# Altium schematic sheet led_ring.SchDoc
size A4
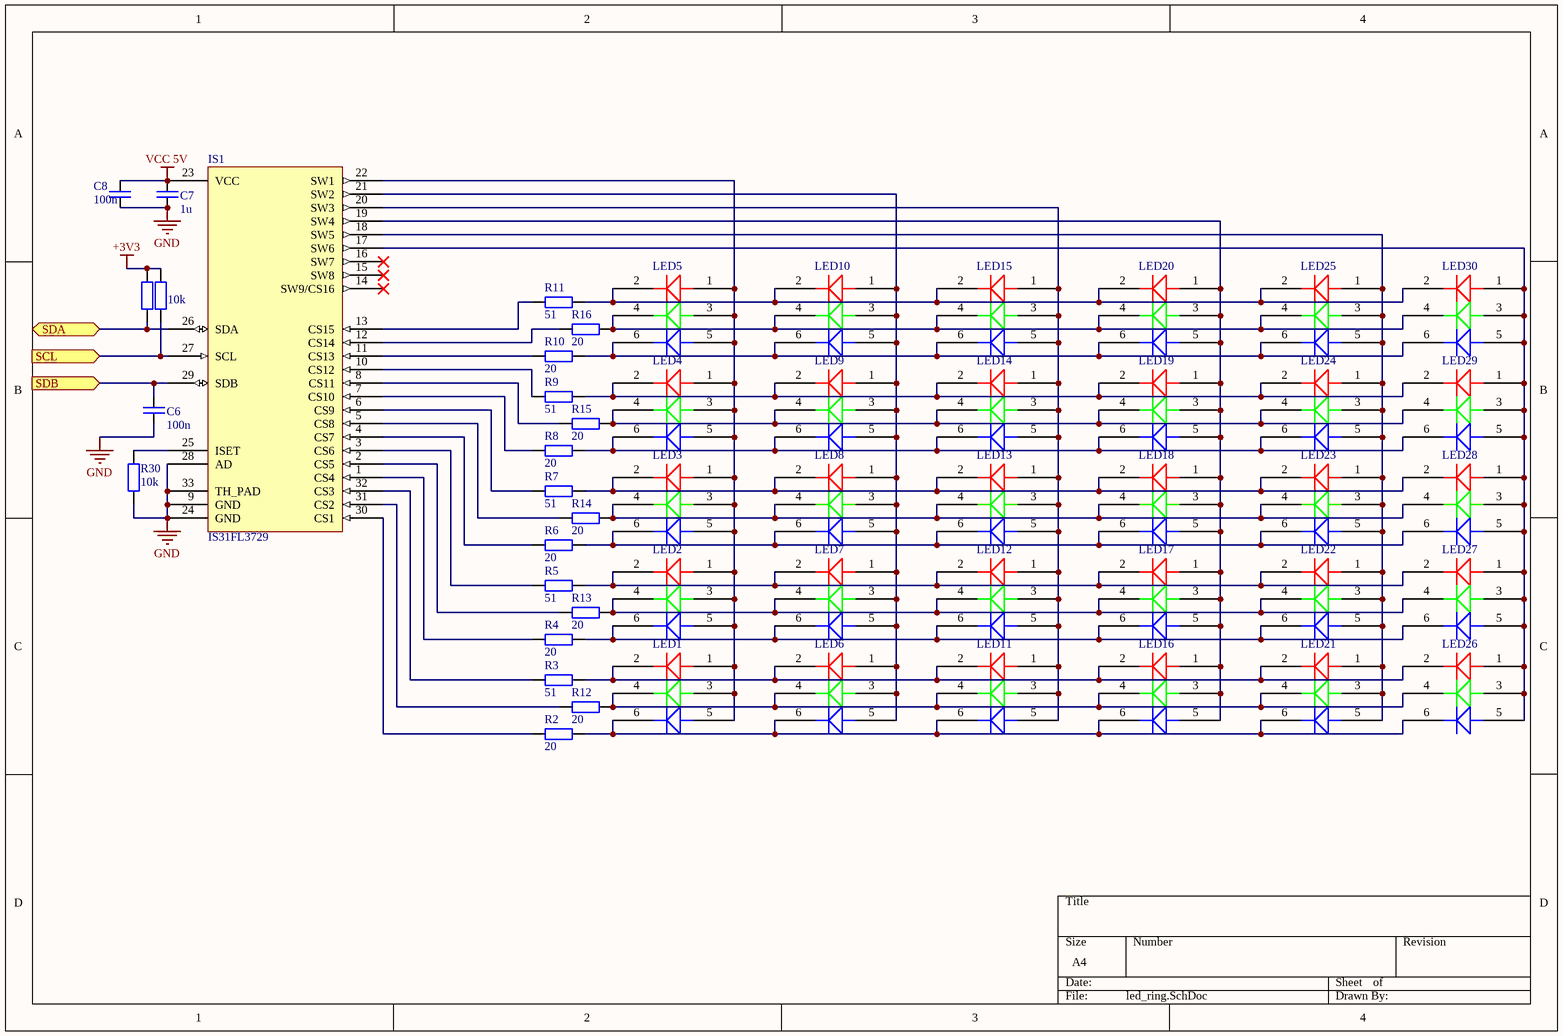
[diagram p0: led_ring.SchDoc]

## Parts
C6  100n  [R1005_0402i_L]
C7  1u  [C1608_0603I_L]
C8  100n  [R1005_0402i_L]
IS1  IS31FL3729  [QFN40P400X400X80_HS-33L]
LED1  SMB-LED  [ASMB-LED]  (value not drawn)
LED2  SMB-LED  [ASMB-LED]  (value not drawn)
LED3  SMB-LED  [ASMB-LED]  (value not drawn)
LED4  SMB-LED  [ASMB-LED]  (value not drawn)
LED5  SMB-LED  [ASMB-LED]  (value not drawn)
LED6  SMB-LED  [ASMB-LED]  (value not drawn)
LED7  SMB-LED  [ASMB-LED]  (value not drawn)
LED8  SMB-LED  [ASMB-LED]  (value not drawn)
LED9  SMB-LED  [ASMB-LED]  (value not drawn)
LED10  SMB-LED  [ASMB-LED]  (value not drawn)
LED11  SMB-LED  [ASMB-LED]  (value not drawn)
LED12  SMB-LED  [ASMB-LED]  (value not drawn)
LED13  SMB-LED  [ASMB-LED]  (value not drawn)
LED14  SMB-LED  [ASMB-LED]  (value not drawn)
LED15  SMB-LED  [ASMB-LED]  (value not drawn)
LED16  SMB-LED  [ASMB-LED]  (value not drawn)
LED17  SMB-LED  [ASMB-LED]  (value not drawn)
LED18  SMB-LED  [ASMB-LED]  (value not drawn)
LED19  SMB-LED  [ASMB-LED]  (value not drawn)
LED20  SMB-LED  [ASMB-LED]  (value not drawn)
LED21  SMB-LED  [ASMB-LED]  (value not drawn)
LED22  SMB-LED  [ASMB-LED]  (value not drawn)
LED23  SMB-LED  [ASMB-LED]  (value not drawn)
LED24  SMB-LED  [ASMB-LED]  (value not drawn)
LED25  SMB-LED  [ASMB-LED]  (value not drawn)
LED26  SMB-LED  [ASMB-LED]  (value not drawn)
LED27  SMB-LED  [ASMB-LED]  (value not drawn)
LED28  SMB-LED  [ASMB-LED]  (value not drawn)
LED29  SMB-LED  [ASMB-LED]  (value not drawn)
LED30  SMB-LED  [ASMB-LED]  (value not drawn)
R2  20  [R1005_0402i_L]
R3  51  [R1005_0402i_L]
R4  20  [R1005_0402i_L]
R5  51  [R1005_0402i_L]
R6  20  [R1005_0402i_L]
R7  51  [R1005_0402i_L]
R8  20  [R1005_0402i_L]
R9  51  [R1005_0402i_L]
R10  20  [R1005_0402i_L]
R11  51  [R1005_0402i_L]
R12  20  [R1005_0402i_L]
R13  20  [R1005_0402i_L]
R14  20  [R1005_0402i_L]
R15  20  [R1005_0402i_L]
R16  20  [R1005_0402i_L]
R27  10k  [R1005_0402i_L]  (value not drawn)
R28  10k  [R1005_0402i_L]
R30  10k  [R1005_0402i_L]

## Ports
SCL (in), SDA (bidir), SDB (in)

## Nets
+3V3: R27.1 R28.1
GND: C6.2 C7.2 C8.2 IS1.9(GND) IS1.24(GND) IS1.28(AD) IS1.33(TH_PAD) R30.2
VCC 5V: C7.1 C8.1 IS1.23(VCC)
SCL: IS1.27(SCL) R28.2 ; port SCL
SDA: IS1.26(SDA) R27.2 ; port SDA
SDB: C6.1 IS1.29(SDB) ; port SDB
NetIS1_1: IS1.1(CS4) R4.1
NetIS1_2: IS1.2(CS5) R13.1
NetIS1_3: IS1.3(CS6) R5.1
NetIS1_4: IS1.4(CS7) R6.1
NetIS1_5: IS1.5(CS8) R14.1
NetIS1_6: IS1.6(CS9) R7.1
NetIS1_7: IS1.7(CS10) R8.1
NetIS1_8: IS1.8(CS11) R15.1
NetIS1_10: IS1.10(CS12) R9.1
NetIS1_11: IS1.11(CS13) R10.1
NetIS1_12: IS1.12(CS14) R16.1
NetIS1_13: IS1.13(CS15) R11.1
NetIS1_17: IS1.17(SW6) LED26.1 LED26.3 LED26.5 LED27.1 LED27.3 LED27.5 LED28.1 LED28.3 LED28.5 LED29.1 LED29.3 LED29.5 LED30.1 LED30.3 LED30.5
NetIS1_18: IS1.18(SW5) LED21.1 LED21.3 LED21.5 LED22.1 LED22.3 LED22.5 LED23.1 LED23.3 LED23.5 LED24.1 LED24.3 LED24.5 LED25.1 LED25.3 LED25.5
NetIS1_19: IS1.19(SW4) LED16.1 LED16.3 LED16.5 LED17.1 LED17.3 LED17.5 LED18.1 LED18.3 LED18.5 LED19.1 LED19.3 LED19.5 LED20.1 LED20.3 LED20.5
NetIS1_20: IS1.20(SW3) LED11.1 LED11.3 LED11.5 LED12.1 LED12.3 LED12.5 LED13.1 LED13.3 LED13.5 LED14.1 LED14.3 LED14.5 LED15.1 LED15.3 LED15.5
NetIS1_21: IS1.21(SW2) LED6.1 LED6.3 LED6.5 LED7.1 LED7.3 LED7.5 LED8.1 LED8.3 LED8.5 LED9.1 LED9.3 LED9.5 LED10.1 LED10.3 LED10.5
NetIS1_22: IS1.22(SW1) LED1.1 LED1.3 LED1.5 LED2.1 LED2.3 LED2.5 LED3.1 LED3.3 LED3.5 LED4.1 LED4.3 LED4.5 LED5.1 LED5.3 LED5.5
NetIS1_25: IS1.25(ISET) R30.1
NetIS1_30: IS1.30(CS1) R2.1
NetIS1_31: IS1.31(CS2) R12.1
NetIS1_32: IS1.32(CS3) R3.1
NetLED1_2: LED1.2 LED6.2 LED11.2 LED16.2 LED21.2 LED26.2 R3.2
NetLED1_4: LED1.4 LED6.4 LED11.4 LED16.4 LED21.4 LED26.4 R12.2
NetLED1_6: LED1.6 LED6.6 LED11.6 LED16.6 LED21.6 LED26.6 R2.2
NetLED2_2: LED2.2 LED7.2 LED12.2 LED17.2 LED22.2 LED27.2 R5.2
NetLED2_4: LED2.4 LED7.4 LED12.4 LED17.4 LED22.4 LED27.4 R13.2
NetLED2_6: LED2.6 LED7.6 LED12.6 LED17.6 LED22.6 LED27.6 R4.2
NetLED3_2: LED3.2 LED8.2 LED13.2 LED18.2 LED23.2 LED28.2 R7.2
NetLED3_4: LED3.4 LED8.4 LED13.4 LED18.4 LED23.4 LED28.4 R14.2
NetLED3_6: LED3.6 LED8.6 LED13.6 LED18.6 LED23.6 LED28.6 R6.2
NetLED4_2: LED4.2 LED9.2 LED14.2 LED19.2 LED24.2 LED29.2 R9.2
NetLED4_4: LED4.4 LED9.4 LED14.4 LED19.4 LED24.4 LED29.4 R15.2
NetLED4_6: LED4.6 LED9.6 LED14.6 LED19.6 LED24.6 LED29.6 R8.2
NetLED5_2: LED5.2 LED10.2 LED15.2 LED20.2 LED25.2 LED30.2 R11.2
NetLED5_4: LED5.4 LED10.4 LED15.4 LED20.4 LED25.4 LED30.4 R16.2
NetLED5_6: LED5.6 LED10.6 LED15.6 LED20.6 LED25.6 LED30.6 R10.2

Not connected (* = marked no-connect by the designer): IS1 14(SW9/CS16)* 15(SW8)* 16(SW7)*

## Library data of the parts
C6-C8 = C: Capacitor
LED1-LED30 = ASMB-LED
R2-R16 R27 R28 R30 = R